# EAGLE design antenas_mod (EAGLE 7.1.0)
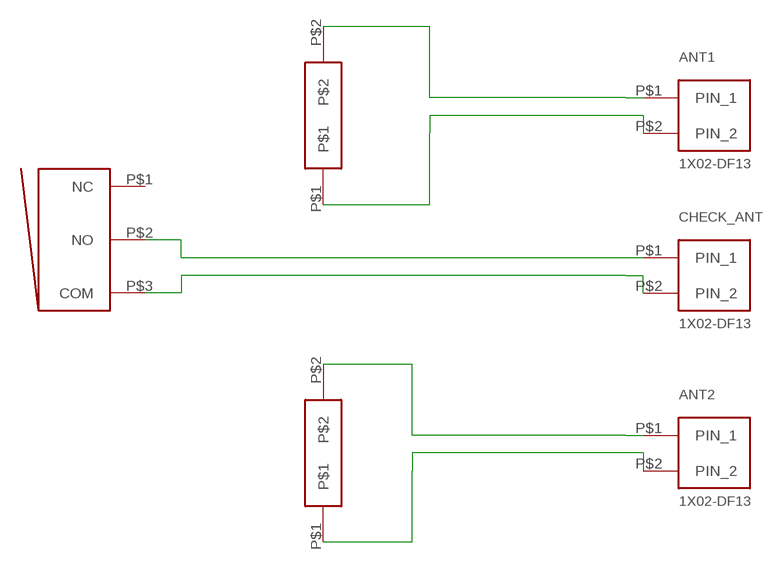
[diagram p0: schematic, sheet 1]

## Parts
ANT1  1X02-DF13  [DF-13]
ANT2  1X02-DF13  [DF-13]
CHECK_ANT  1X02-DF13  [DF-13]
U$1  SWITCH_ANT_TRHU  [3_HOLE]
U$5  RPOWER  [RPOWER]
U$6  RPOWER  [RPOWER]

## Nets
COM: CHECK_ANT.P$2(PIN_2) U$1.P$3(COM)
N$9: ANT1.P$1(PIN_1) U$5.P$2
N$10: ANT1.P$2(PIN_2) U$5.P$1
N$11: ANT2.P$1(PIN_1) U$6.P$2
N$12: ANT2.P$2(PIN_2) U$6.P$1
NO: CHECK_ANT.P$1(PIN_1) U$1.P$2(NO)
Unconnected: U$1.P$1(NC)

## Library data of the parts
ANT1 ANT2 CHECK_ANT = SUCHAI:1X02-DF13
U$1 = SUCHAI:SWITCH_ANT_TRHU
U$5 U$6 = SUCHAI:RPOWER

## Board
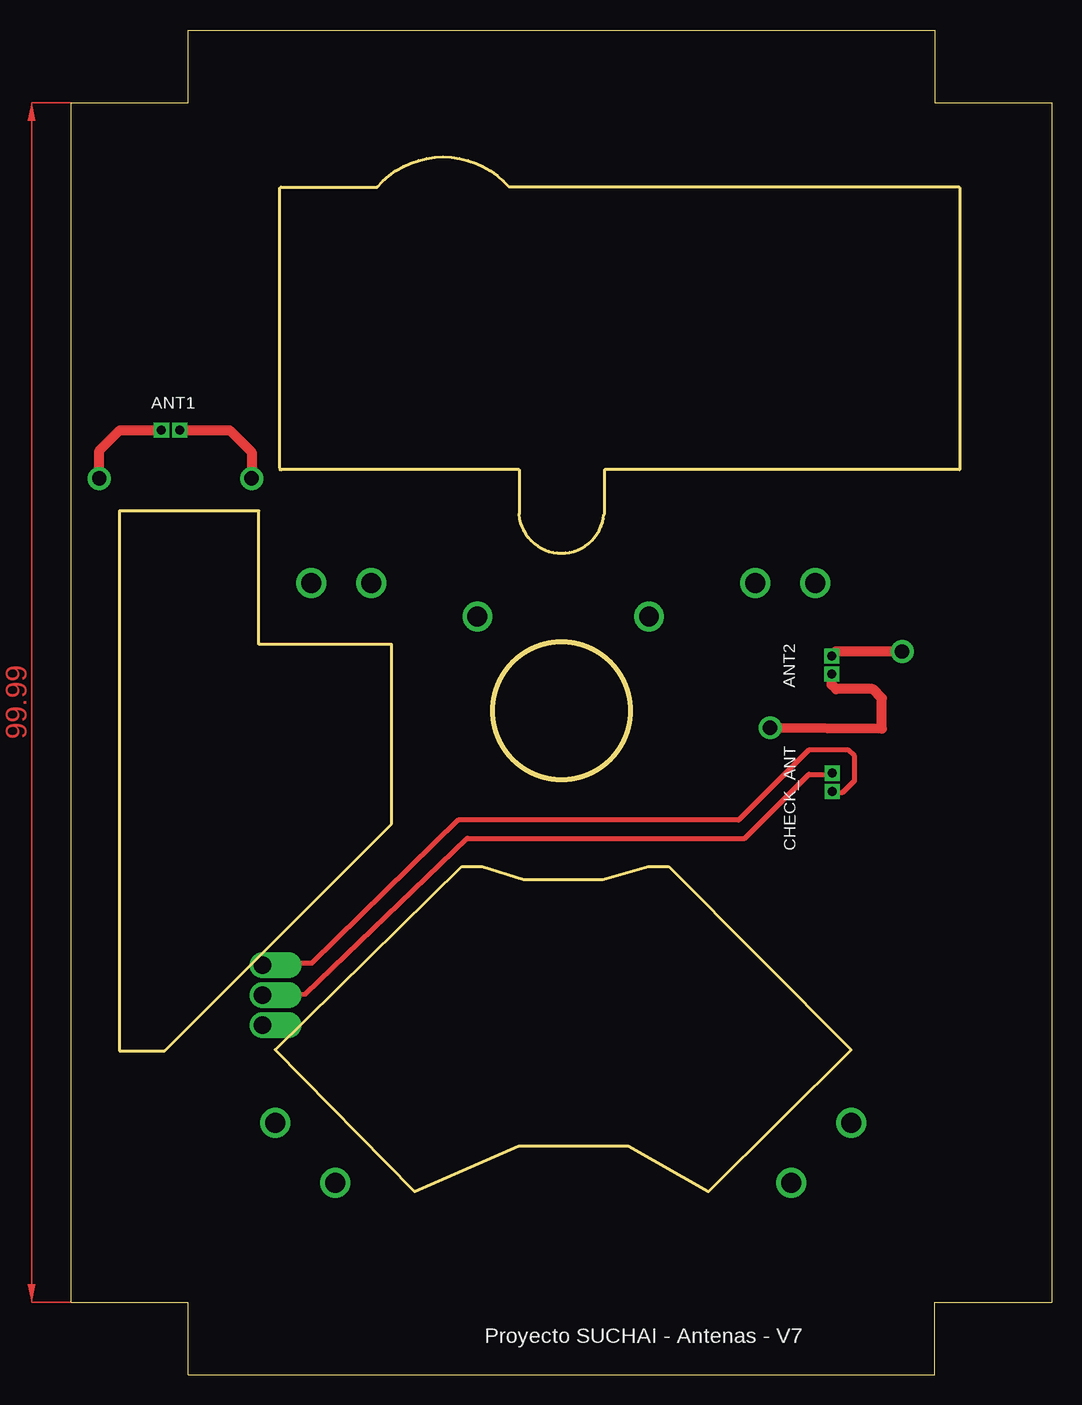
[diagram p1: board, top side]

Size 81.73 x 112.1 mm. Coordinates in mm from the lower left corner, seen from the top.
Outline: 0,6.06 9.76,6.06 9.76,0 71.97,0
Outline: 0.01,6.05 0,6.05 0,106.04 9.76,106.04 9.76,112.1 71.97,112.1 71.97,106.04 81.73,106.04
Outline: 71.98,0 71.97,0
Outline: 71.97,0 71.97,6.06 81.73,6.06 81.73,106.04
Outline: 81.38,106.05 81.73,106.04
Outline: 17.4,75.56 17.4,98.93
Outline: 74.04,98.93 74.04,75.44 44.45,75.44 44.45,71.75
Outline: 17.53,75.44 37.34,75.44 37.34,71.75
Outline: 17.5,99 25.5,99 arc-98 36.5,99 74,99
Outline: 37.3,71.7 arc169 44.4,71.7
Outline: 17,27.1 32.56,42.36 34.26,42.36 37.7,41.28 44.28,41.28 48.09,42.36 49.8,42.36 65,27.1 53.11,15.25 46.44,19.05 37.3,19.05 28.62,15.25 17,27.1
Outline: 4.01,72.01 4.01,27.01 7.78,27.01 26.69,45.93 26.69,60.89 15.64,60.89 15.64,72.01 4.01,72.01
Outline: circle at 40.87,55.34 radius 5.74
Copper layers (1*16): Top 0.035mm / dielectric 1.5mm / Bottom 0.035mm
Design rules "default *": minimum track width 10mil, minimum drill 28mil, track to track 12mil, track to pad 12mil, pad to pad 12mil, via to via 12mil, smd to smd 12mil, copper to edge 40mil, drill to drill 8mil, minimum pad ring 10mil, minimum via ring 8mil, stop-mask expansion 4mil, vias tented up to drill 0mil, thermal gap 20mil
Milling: 1 lines

### Footprints (pad centres in the part's own frame; a part is rotated, then mirrored left to right if it is on the bottom)
DF-13 = drill 0.75 pad 1 square: P$1 0,0; P$2 1.524,0
3_HOLE = drill 1.45 pad 1.9 offset: P$1 0,0; P$2 2.5,0; P$3 5,0
RPOWER = drill 1.2 pad 1.9: P$1 0,0; P$2 12.7,0

### Placement (x,y rotation side)
ANT1  9.05,78.75 180 top
ANT2  63.37,59.92 270 top
CHECK_ANT  63.42,50.14 270 top
U$1  15.93,29.15 90 bottom
U$5  2.34,74.71 0 top
U$6  58.25,53.94 30 top

### Tracks (layer width: path | path; a pad name or v marks a point on that pad's centre or on a via)
COM
  Top 0.406: CHECK_ANT.P$2 63.5,48.54 64.29,48.54 65.28,49.53 65.28,51.56 64.77,52.07 61.47,52.07 55.63,46.23 32.26,46.23 20.07,34.29 16.04,34.29 U$1.P$3
N$2  (via drill 1.65)
  other vias: 20,66
N$4  (via drill 1.65)
  other vias: 62,66
N$5  (via drill 1.65)
  other vias: 65,21
N$6  (via drill 1.65)
  other vias: 17,21
N$7  (via drill 1.65)
  other vias: 22,16
N$8  (via drill 1.65)
  other vias: 60,16
N$9
  Top 0.813: U$5.P$2 15.04,76.91 13.21,78.74 9.85,78.74 ANT1.P$1
N$10
  Top 0.813: U$5.P$1 2.34,77.02 4.06,78.74 7.03,78.74 ANT1.P$2
N$11
  Top 0.813: U$6.P$2 63.74,60.29 ANT2.P$1
N$12
  Top 0.813: ANT2.P$2 63.38,57.53 63.75,57.15 66.8,57.15 67.56,56.39 67.56,53.86 U$6.P$1
N$13  (via drill 1.65)
  other vias: 33.85,63.2
N$14  (via drill 1.65)
  other vias: 48.15,63.2
N$15  (via drill 1.65)
  other vias: 25,66
N$17  (via drill 1.65)
  other vias: 57,66
NO
  Top 0.406: U$1.P$2 19.52,31.72 33.02,44.7 56.13,44.7 61.47,50.04 63.31,50.04 CHECK_ANT.P$1
(copper drawn outside any net)
  shapes: Top area x1

### Text on the board
tNames: Proyecto SUCHAI - Antenas - V7